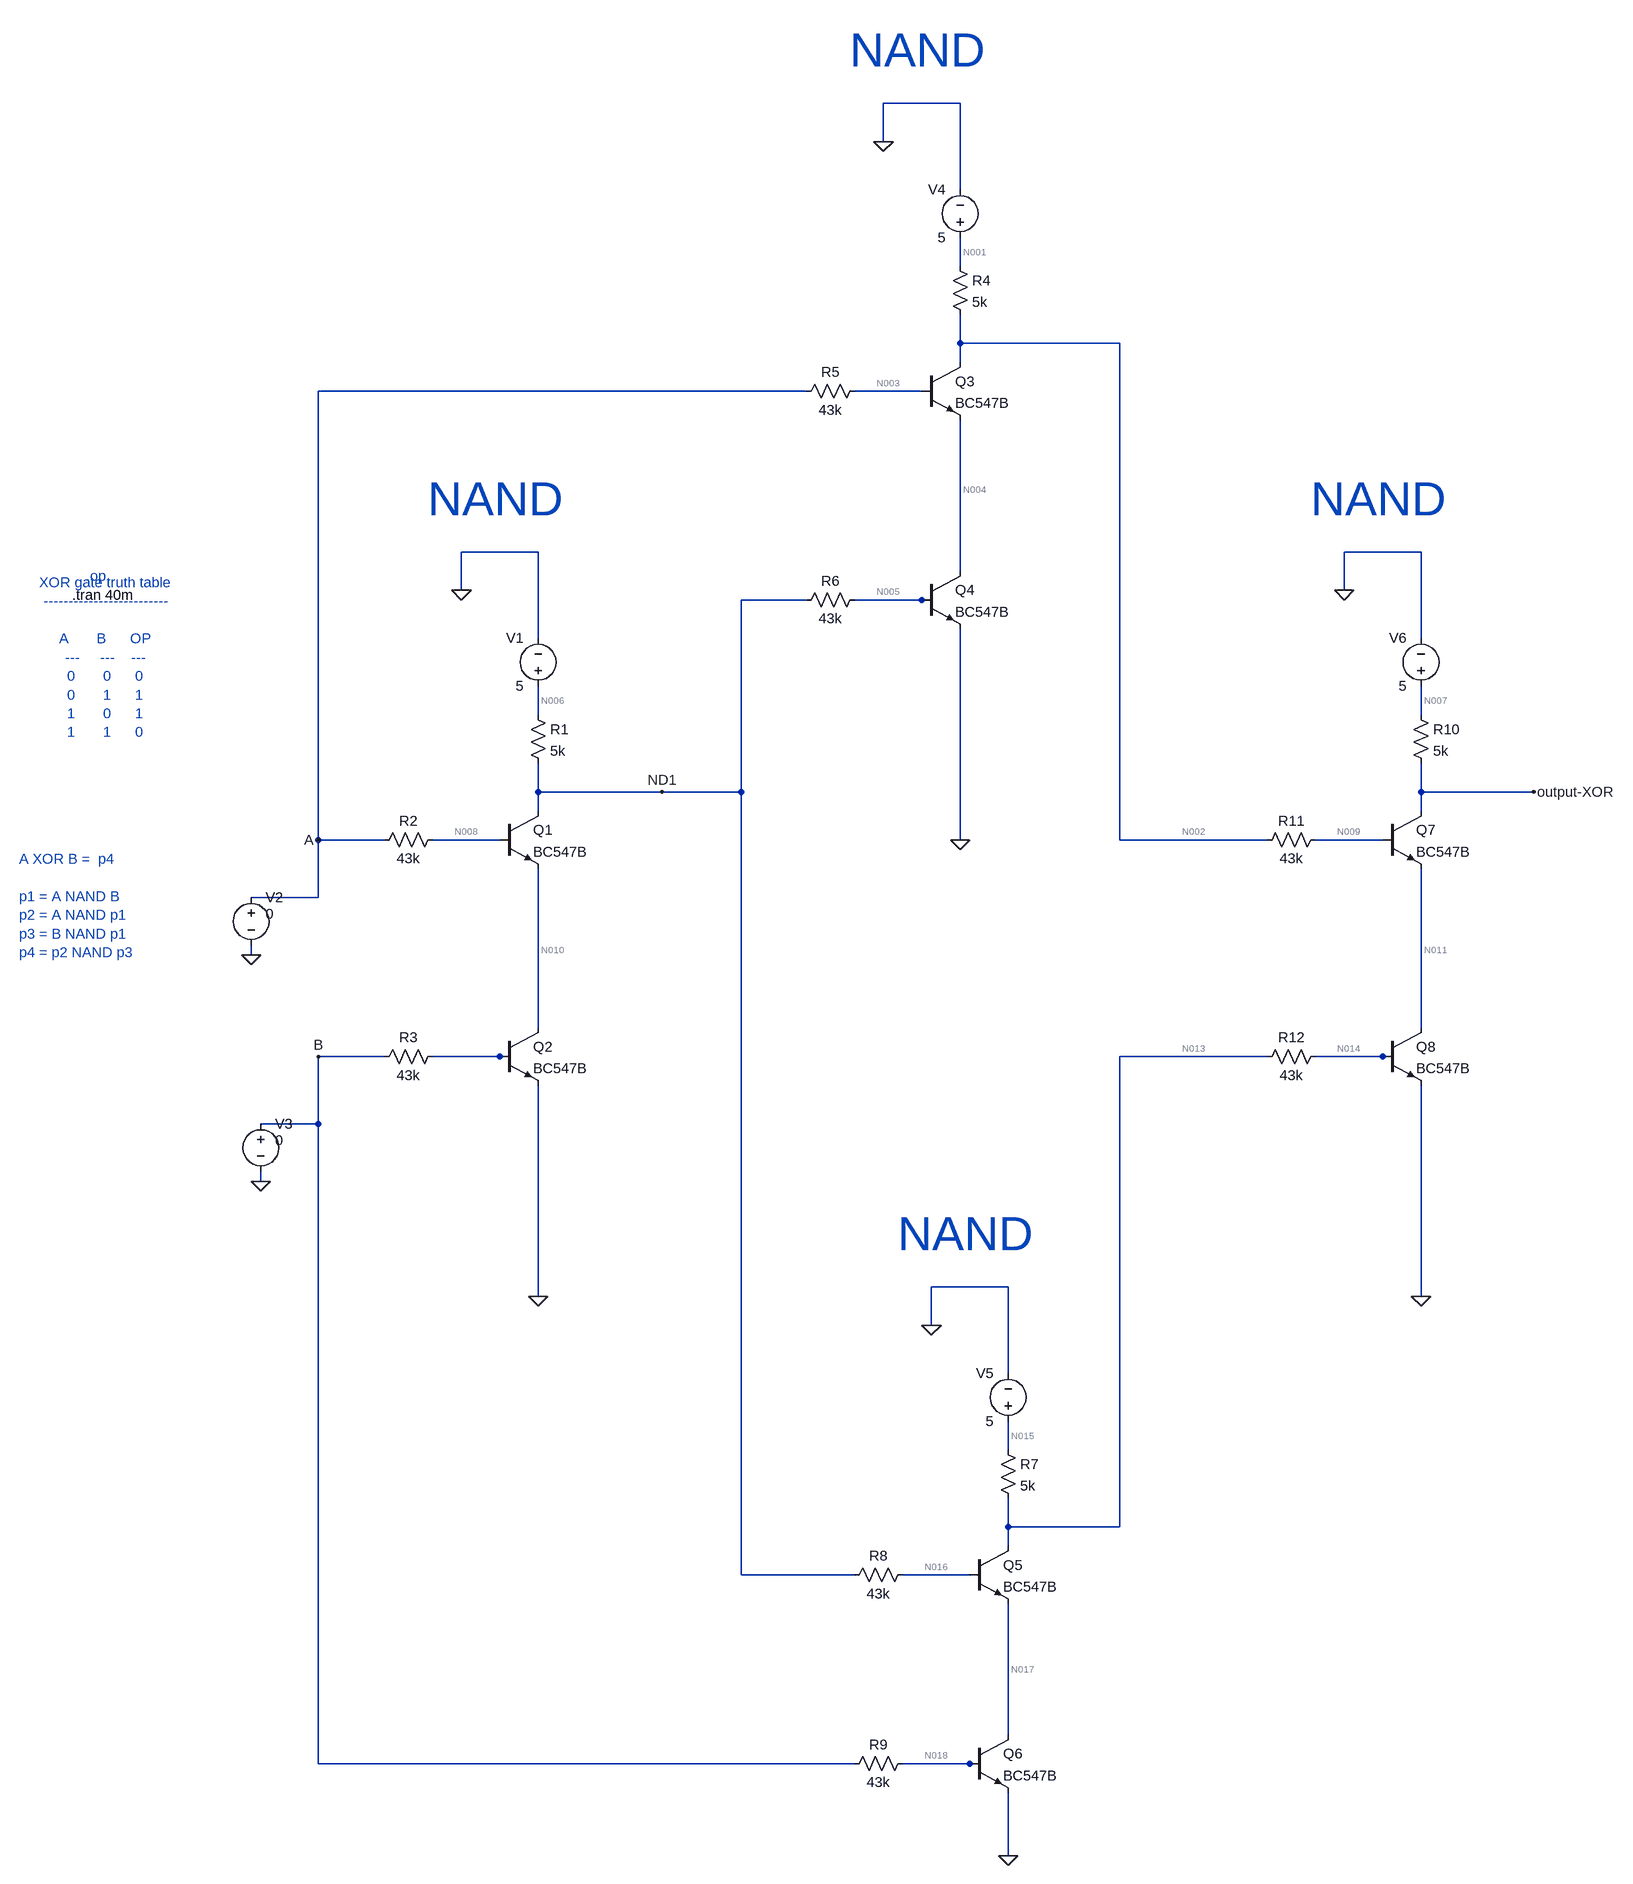
[diagram p0: schematic XOR_gate_using_NAND_gate.asc]
XOR_gate_using_NAND_gate.asc, the LTspice schematic file:
Version 4.1
SHEET 1 5004 2404
WIRE 1680 -1152 1552 -1152
WIRE 1552 -1088 1552 -1152
WIRE 1680 -1008 1680 -1152
WIRE 1680 -880 1680 -928
WIRE 1680 -752 1680 -800
WIRE 2304 -752 1680 -752
WIRE 1680 -720 1680 -752
WIRE 1424 -672 -128 -672
WIRE 1616 -672 1504 -672
WIRE 240 -384 112 -384
WIRE 3248 -384 3120 -384
WIRE 1680 -352 1680 -624
WIRE 112 -320 112 -384
WIRE 3120 -320 3120 -384
WIRE 1424 -304 832 -304
WIRE 1616 -304 1504 -304
WIRE 1632 -304 1616 -304
WIRE 240 -240 240 -384
WIRE 3248 -240 3248 -384
WIRE 240 -112 240 -160
WIRE 3248 -112 3248 -160
WIRE 240 16 240 -32
WIRE 480 16 240 16
WIRE 832 16 832 -304
WIRE 832 16 480 16
WIRE 3248 16 3248 -32
WIRE 3856 16 3248 16
WIRE 240 48 240 16
WIRE 3248 48 3248 16
WIRE -128 96 -128 -672
WIRE -16 96 -128 96
WIRE 176 96 64 96
WIRE 1680 96 1680 -256
WIRE 2304 96 2304 -752
WIRE 2992 96 2304 96
WIRE 3184 96 3072 96
WIRE -128 192 -128 96
WIRE -128 192 -240 192
WIRE -240 288 -240 272
WIRE 240 416 240 144
WIRE 3248 416 3248 144
WIRE -16 464 -128 464
WIRE 176 464 64 464
WIRE 192 464 176 464
WIRE 2992 464 2304 464
WIRE 3184 464 3072 464
WIRE 3200 464 3184 464
WIRE -128 576 -128 464
WIRE -128 576 -224 576
WIRE -224 672 -224 656
WIRE 1760 848 1632 848
WIRE 240 864 240 512
WIRE 3248 864 3248 512
WIRE 1632 912 1632 848
WIRE 1760 992 1760 848
WIRE 1760 1120 1760 1072
WIRE 1760 1248 1760 1200
WIRE 2304 1248 2304 464
WIRE 2304 1248 1760 1248
WIRE 1760 1280 1760 1248
WIRE 832 1328 832 16
WIRE 1504 1328 832 1328
WIRE 1696 1328 1584 1328
WIRE 1760 1648 1760 1376
WIRE -128 1696 -128 576
WIRE 1504 1696 -128 1696
WIRE 1696 1696 1584 1696
WIRE 1712 1696 1696 1696
WIRE 1760 2096 1760 1744
FLAG -128 96 A
FLAG 112 -320 0
FLAG 480 16 ND1
FLAG 240 864 0
FLAG -128 464 B
FLAG -240 288 0
FLAG -224 672 0
FLAG 1552 -1088 0
FLAG 1680 96 0
FLAG 1632 912 0
FLAG 1760 2096 0
FLAG 3120 -320 0
FLAG 3856 16 output-XOR
FLAG 3248 864 0
SYMBOL npn 176 48 R0
SYMATTR InstName Q1
SYMATTR Value BC547B
SYMBOL voltage 240 -144 R180
WINDOW 0 24 96 Left 2
WINDOW 3 24 16 Left 2
WINDOW 123 0 0 Left 0
WINDOW 39 0 0 Left 0
SYMATTR InstName V1
SYMATTR Value 5
SYMBOL res 224 -128 R0
SYMATTR InstName R1
SYMATTR Value 5k
SYMBOL res 80 80 R90
WINDOW 0 0 56 VBottom 2
WINDOW 3 32 56 VTop 2
SYMATTR InstName R2
SYMATTR Value 43k
SYMBOL npn 176 416 R0
SYMATTR InstName Q2
SYMATTR Value BC547B
SYMBOL res 80 448 R90
WINDOW 0 0 56 VBottom 2
WINDOW 3 32 56 VTop 2
SYMATTR InstName R3
SYMATTR Value 43k
SYMBOL voltage -240 176 R0
WINDOW 3 24 44 Left 2
WINDOW 123 0 0 Left 0
WINDOW 39 0 0 Left 0
SYMATTR Value 0
SYMATTR InstName V2
SYMBOL voltage -224 560 R0
WINDOW 3 24 44 Left 2
WINDOW 123 0 0 Left 0
WINDOW 39 0 0 Left 0
SYMATTR Value 0
SYMATTR InstName V3
SYMBOL npn 1616 -720 R0
SYMATTR InstName Q3
SYMATTR Value BC547B
SYMBOL voltage 1680 -912 R180
WINDOW 0 24 96 Left 2
WINDOW 3 24 16 Left 2
WINDOW 123 0 0 Left 0
WINDOW 39 0 0 Left 0
SYMATTR InstName V4
SYMATTR Value 5
SYMBOL res 1664 -896 R0
SYMATTR InstName R4
SYMATTR Value 5k
SYMBOL res 1520 -688 R90
WINDOW 0 0 56 VBottom 2
WINDOW 3 32 56 VTop 2
SYMATTR InstName R5
SYMATTR Value 43k
SYMBOL npn 1616 -352 R0
SYMATTR InstName Q4
SYMATTR Value BC547B
SYMBOL res 1520 -320 R90
WINDOW 0 0 56 VBottom 2
WINDOW 3 32 56 VTop 2
SYMATTR InstName R6
SYMATTR Value 43k
SYMBOL npn 1696 1280 R0
SYMATTR InstName Q5
SYMATTR Value BC547B
SYMBOL voltage 1760 1088 R180
WINDOW 0 24 96 Left 2
WINDOW 3 24 16 Left 2
WINDOW 123 0 0 Left 0
WINDOW 39 0 0 Left 0
SYMATTR InstName V5
SYMATTR Value 5
SYMBOL res 1744 1104 R0
SYMATTR InstName R7
SYMATTR Value 5k
SYMBOL res 1600 1312 R90
WINDOW 0 0 56 VBottom 2
WINDOW 3 32 56 VTop 2
SYMATTR InstName R8
SYMATTR Value 43k
SYMBOL npn 1696 1648 R0
SYMATTR InstName Q6
SYMATTR Value BC547B
SYMBOL res 1600 1680 R90
WINDOW 0 0 56 VBottom 2
WINDOW 3 32 56 VTop 2
SYMATTR InstName R9
SYMATTR Value 43k
SYMBOL npn 3184 48 R0
SYMATTR InstName Q7
SYMATTR Value BC547B
SYMBOL voltage 3248 -144 R180
WINDOW 0 24 96 Left 2
WINDOW 3 24 16 Left 2
WINDOW 123 0 0 Left 0
WINDOW 39 0 0 Left 0
SYMATTR InstName V6
SYMATTR Value 5
SYMBOL res 3232 -128 R0
SYMATTR InstName R10
SYMATTR Value 5k
SYMBOL res 3088 80 R90
WINDOW 0 0 56 VBottom 2
WINDOW 3 32 56 VTop 2
SYMATTR InstName R11
SYMATTR Value 43k
SYMBOL npn 3184 416 R0
SYMATTR InstName Q8
SYMATTR Value BC547B
SYMBOL res 3088 448 R90
WINDOW 0 0 56 VBottom 2
WINDOW 3 32 56 VTop 2
SYMATTR InstName R12
SYMATTR Value 43k
TEXT -712 -312 Left 2 !.tran 40m
TEXT -688 -344 Left 2 ;.op
TEXT -656 -208 Center 2 ;XOR gate truth table\n-------------------------\n \nA       B      OP\n---     ---    ---\n0       0      0\n0       1      1\n1       0      1\n1       1      0
TEXT -800 128 Left 2 ;A XOR B =  p4\n \np1 = A NAND B\np2 = A NAND p1\np3 = B NAND p1\np4 = p2 NAND p3
TEXT 56 -472 Left 6 ;NAND
TEXT 1496 -1240 Left 6 ;NAND
TEXT 1576 760 Left 6 ;NAND
TEXT 3064 -472 Left 6 ;NAND

The netlist it stands for:
* XOR_gate_using_NAND_gate.asc
Q1 ND1 N008 N010 0 BC547B
V1 N006 0 5
R1 N006 ND1 5k
R2 N008 A 43k
Q2 N010 N012 0 0 BC547B
R3 N012 B 43k
V2 A 0 0
V3 B 0 0
Q3 N002 N003 N004 0 BC547B
V4 N001 0 5
R4 N001 N002 5k
R5 N003 A 43k
Q4 N004 N005 0 0 BC547B
R6 N005 ND1 43k
Q5 N013 N016 N017 0 BC547B
V5 N015 0 5
R7 N015 N013 5k
R8 N016 ND1 43k
Q6 N017 N018 0 0 BC547B
R9 N018 B 43k
Q7 output-XOR N009 N011 0 BC547B
V6 N007 0 5
R10 N007 output-XOR 5k
R11 N009 N002 43k
Q8 N011 N014 0 0 BC547B
R12 N014 N013 43k
.model NPN NPN
.model PNP PNP
.lib standard.bjt
.tran 40m
* .op
* XOR gate truth table
* -------------------------
* A       B      OP
* ---     ---    ---
* 0       0      0
* 0       1      1
* 1       0      1
* 1       1      0
* A XOR B =  p4
* p1 = A NAND B
* p2 = A NAND p1
* p3 = B NAND p1
* p4 = p2 NAND p3
* NAND
* NAND
* NAND
* NAND
.backanno
.end

* Results of the author's LTspice run, read from the files saved beside the schematic
* Operating Point, zero values left out:
*   V(n008) = 198.4 nV
*   V(n006) = 5 V
*   V(n004) = 6.369 mV
*   V(n005) = 627.6 mV
*   V(n013) = 4.547 V
*   V(n017) = 4.409 V
*   V(output-xor) = 67.19 mV
*   V(n011) = 34.34 mV
*   V(nd1) = 4.545 V
*   V(n010) = 4.444 mV
*   V(n002) = 4.551 V
*   V(n003) = 198.8 nV
*   V(n001) = 5 V
*   V(n016) = 4.545 V
*   V(n015) = 5 V
*   V(n018) = 192.4 nV
*   V(n009) = 686.1 mV
*   V(n007) = 5 V
*   V(n014) = 653.3 mV
*   Ic(Q1) = 4.632 pA
*   Ib(Q1) = -4.615 pA
*   I(R4) = 89.87 µA
*   I(R6) = -91.09 µA
*   I(V5) = -90.56 µA
*   Ic(Q7) = 986.6 µA
*   Ib(Q7) = 89.87 µA
*   Ie(Q7) = -1.076 mA
*   I(R1) = 91.09 µA
*   I(V3) = 4.488 pA
*   Ib(Q4) = 91.09 µA
*   Ie(Q4) = -91.09 µA
*   Ic(Q6) = 4.5 pA
*   Ib(Q6) = -4.475 pA
*   I(R11) = -89.87 µA
*   I(R12) = -90.56 µA
*   I(V1) = -91.09 µA
*   I(R2) = 4.615 pA
*   I(R5) = 4.623 pA
*   Ic(Q5) = 4.255 pA
*   Ie(Q5) = -4.501 pA
*   I(R7) = 90.56 µA
*   I(R9) = 4.475 pA
*   I(R10) = 986.6 µA
*   I(V2) = 9.238 pA
*   Ic(Q3) = 4.636 pA
*   Ib(Q3) = -4.623 pA
*   I(V4) = -89.87 µA
*   I(V6) = -986.6 µA
*   Ic(Q8) = 1.076 mA
*   Ib(Q8) = 90.56 µA
*   Ie(Q8) = -1.167 mA